# EAGLE design programmer (EAGLE 9.1.2)
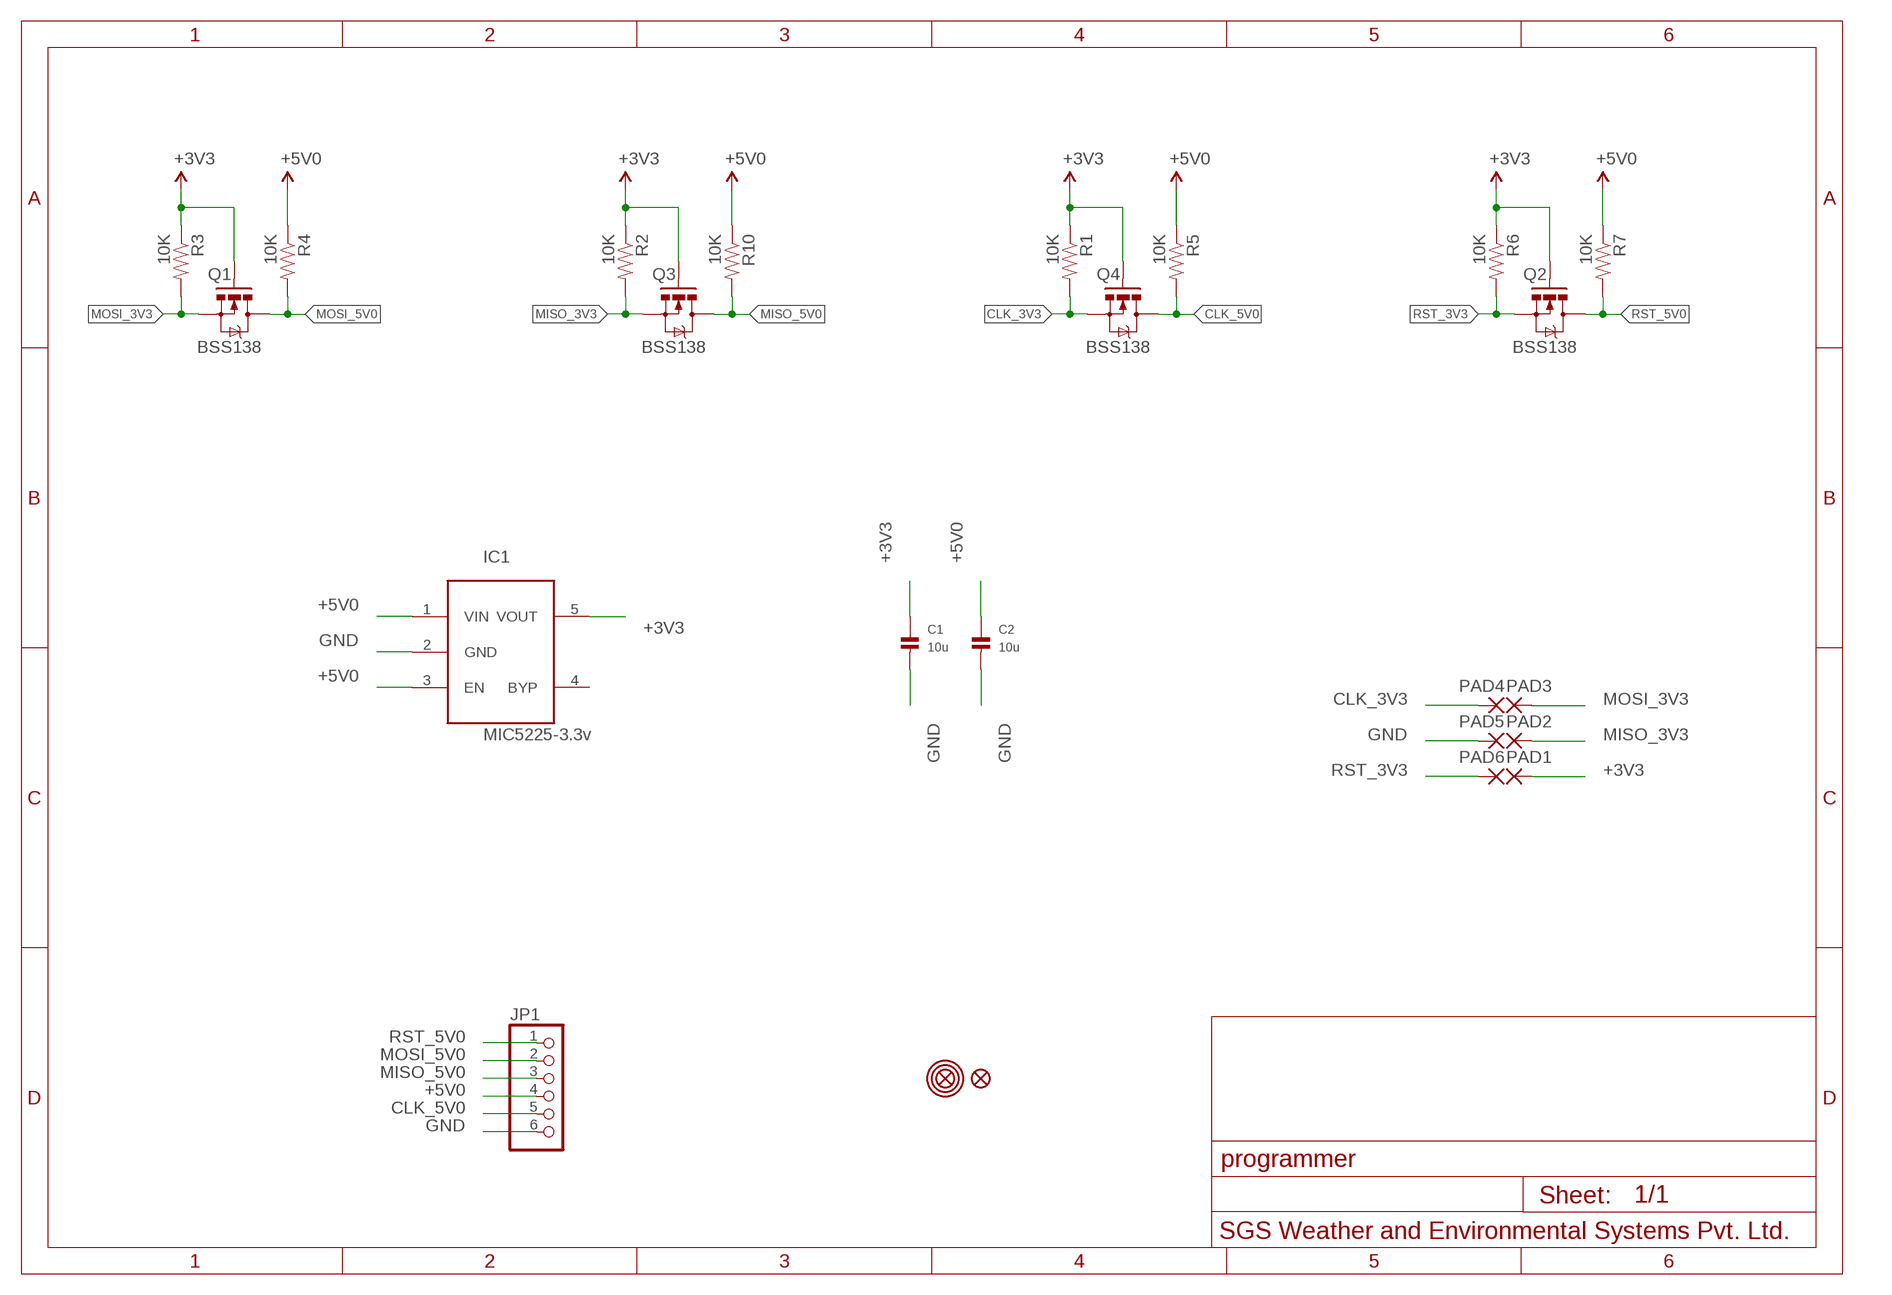
[diagram p0: schematic, sheet 1]

## Parts
C1  10u  CAP_CERAMIC0603  [0603]
C2  10u  CAP_CERAMIC0603  [0603]
FID1  FIDUCIAL1X2.5  [FIDUCIAL-1X2.5]
FID2  FIDUCIAL1X2.5  [FIDUCIAL-1X2.5]
IC1  MIC5225-3.3v  LP298XS  [SOT23-5L]
JP1  HEADER-1X6ROUND  [1X06_ROUND]
PAD1  WIREPADSMD1,27-254  [SMD1,27-2,54]
PAD2  WIREPADSMD1,27-254  [SMD1,27-2,54]
PAD3  WIREPADSMD1,27-254  [SMD1,27-2,54]
PAD4  WIREPADSMD1,27-254  [SMD1,27-2,54]
PAD5  WIREPADSMD1,27-254  [SMD1,27-2,54]
PAD6  WIREPADSMD1,27-254  [SMD1,27-2,54]
Q1  BSS138  MOSFET-NCHANNELSMD  [SOT23-3]
Q2  BSS138  MOSFET-NCHANNELSMD  [SOT23-3]
Q3  BSS138  MOSFET-NCHANNELSMD  [SOT23-3]
Q4  BSS138  MOSFET-NCHANNELSMD  [SOT23-3]
R1  10K  RESISTOR0603-RES  [0603-RES]
R2  10K  RESISTOR0603-RES  [0603-RES]
R3  10K  RESISTOR0603-RES  [0603-RES]
R4  10K  RESISTOR0603-RES  [0603-RES]
R5  10K  RESISTOR0603-RES  [0603-RES]
R6  10K  RESISTOR0603-RES  [0603-RES]
R7  10K  RESISTOR0603-RES  [0603-RES]
R10  10K  RESISTOR0603-RES  [0603-RES]
U$1  MOUNTINGHOLE2.5  [MOUNTINGHOLE_2.5_PLATED]

## Nets
+3V3: C1.1 IC1.5(VOUT) PAD1.1(P) Q1.1(G) Q2.1(G) Q3.1(G) Q4.1(G) R1.1 R2.1 R3.1 R6.1
+5V0: C2.1 IC1.1(VIN) IC1.3(EN) JP1.4 R4.1 R5.1 R7.1 R10.1
CLK_3V3: PAD4.1(P) Q4.2(S) R1.2
CLK_5V0: JP1.5 Q4.3(D) R5.2
GND: C1.2 C2.2 IC1.2(GND) JP1.6 PAD5.1(P)
MISO_3V3: PAD2.1(P) Q3.2(S) R2.2
MISO_5V0: JP1.3 Q3.3(D) R10.2
MOSI_3V3: PAD3.1(P) Q1.2(S) R3.2
MOSI_5V0: JP1.2 Q1.3(D) R4.2
RST_3V3: PAD6.1(P) Q2.2(S) R6.2
RST_5V0: JP1.1 Q2.3(D) R7.2
Unconnected: IC1.4(BYP)

## Library data of the parts
C1 C2 = microbuilder:CAP_CERAMIC: Ceramic Capacitors 0402 - 0402 Surface Mount Capacitors 16pF 50V 5% [Digikey: 445-4899-2-ND] 18pF 50V 5% [Digikey: 490-1281-2-ND] 22pF 50V 5% [Digikey: 490-1283-2-ND] 68pF 50V 5% [Digikey: 490-1289-2-ND] 0.1uF 10V 10% [Digikey: 490-1318-2-ND] 1.0uF 6.3V 10% [Digikey: 490-1320-2-ND] 0603 - 0603 Surface Mount Capacitors 16 pF 50V 5% [Digikey: 445-5051-2-ND] 22 pF 50V [Digikey: PCC220ACVTR-ND] 33 pF 50V 5% [Digikey: 490-1415-1-ND] 56pF 50V 5% [Digikey: 490-1421-1-ND] 220pF 50V 5% [Digikey: 445-1285-1-ND] 680 pF 50V 2200 pF 50V 5% C0G [Digikey: 445-1297-1-ND] 5600 pF 100V 5% X7R [Digikey: 478-3711-1-ND] 0.1 µF 25V 10% [Digikey: PCC2277TR-ND] 0.22 µF 16V 10% X7R [Digikey: 445-1318-1-ND] 1.0 µF 25V 10% [Digikey: 445-5146-2-ND] 0603 - RF Specific 3pF 250V +/-0.1pF RF [Digikey: 712-1347-1-ND] 18 pF 250V 5% [Digikey: 478-3505-1-ND or 712-1322-1-ND] 56 pF 250V 5% C0G RF [Digikey: 490-4867-1-ND] 68 pF 250V RF [Digikey: 490-4868-1-ND] 0805 - 0805 Surface Mount Capacitors 220 pF 250V 2% RF Ceramic Capacitor [Digikey: 712-1398-1-ND] 1000 pF 50V 2% NP0 Ceramic Capacitor [Digikey: 478-3760-1-ND] 0.1 µF 25V 10% Ceramic Capacitor [Digikey: PCC1828TR-ND] 1.0 µF 16V 10% Ceramic Capacitor[Digikey: 490-1691-2-ND] 10.0 µF 10V 10% Ceramic Capacitor[Digikey: 709-1228-1-ND] 10.0 uF 16V 10% Ceramic Capacitor [Digikey: 478-5165-2-ND] 47 uF 6.3V 20% Ceramic Capacitor [Digikey: 587-1779-1-ND or 399-5506-1-ND] 1206 - 1206 Surface Mount Capacitors 47uF 10V 20% Ceramic Capacitor [Digikey: 490-5528-1-ND or 399-5508-1-ND or 445-6010-1-ND] 100uF 6.3V -20%, +80% Y5V Ceramic Capacitor (Digikey: 490-4512-1-ND, Mouser: 81-GRM31CF50J107ZE1L)
FID1 FID2 = microbuilder:FIDUCIAL: Fiducial Alignment Points Various fiducial points for machine vision alignment.; BOM: EXCLUDE
IC1 = adafruit:LP298X
JP1 = microbuilder:HEADER-1X6: PIN HEADER
PAD1-PAD6 = wirepad:WIREPAD: Wire PAD connect wire on PCB
Q1-Q4 = SparkFun:MOSFET-NCHANNEL
R1-R7 R10 = SparkFun:RESISTOR: Resistor Basic schematic elements and footprints for 0603, 1206, and PTH resistors.
U$1 = microbuilder:MOUNTINGHOLE: Mounting Hole For #2 screws (0.086"/2.18mm width, 0.094"/2.4mm hole) use 2.5mm

## Board
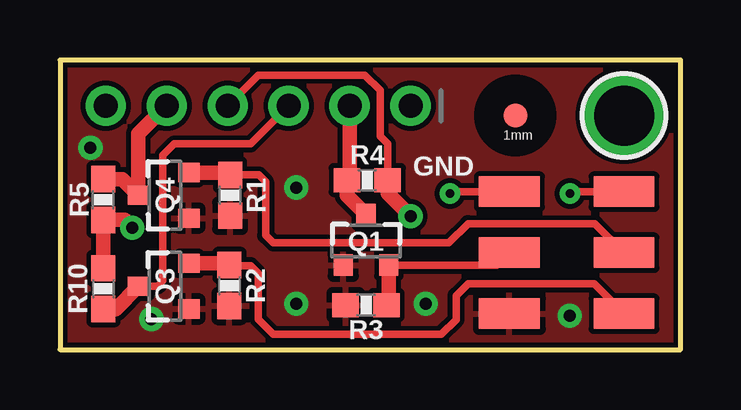
[diagram p1: board, top side]
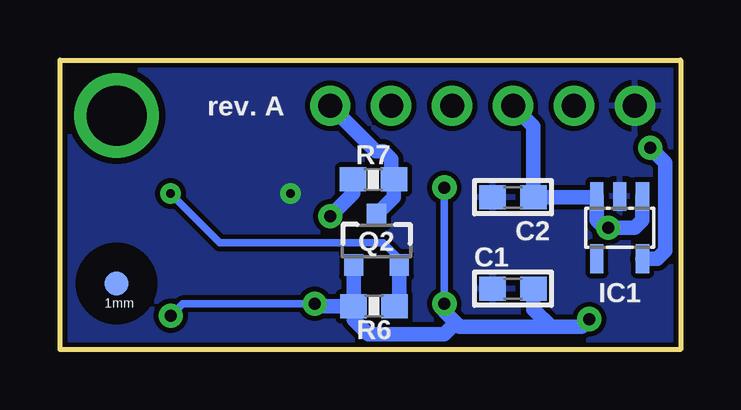
[diagram p2: board, bottom side, seen from below]

Size 25.86 x 12.06 mm. Coordinates in mm from the lower left corner, seen from the top.
Outline: 0,0 25.86,0 25.86,12.06 0,12.06 0,0
Copper layers (1*16): Top 0.035mm / dielectric 1.5mm / Bottom 0.035mm
Design rules "SparkFun *": minimum track width 7mil, minimum drill 15mil, track to track 8mil, track to pad 8mil, pad to pad 8mil, via to via 8mil, smd to smd 8mil, copper to edge 8mil, drill to drill 8mil, minimum pad ring 12mil, minimum via ring 10mil, stop-mask expansion 4mil, vias tented up to drill 20mil, thermal gap 10mil

### Footprints (pad centres in the part's own frame; a part is rotated, then mirrored left to right if it is on the bottom)
0603 = smd 1.1 x 1: 1 -0.85,0; 2 0.85,0
FIDUCIAL-1X2.5 = smd 1 x 1: 1 0,0
SOT23-5L = smd 0.55 x 1.2: 1 -0.95,-1.3; 2 0,-1.3; 3 0.95,-1.3; 4 0.95,1.3; 5 -0.95,1.3
1X06_ROUND = drill 1 pad 1.676: 1 -6.35,0; 2 -3.81,0; 3 -1.27,0; 4 1.27,0; 5 3.81,0; 6 6.35,0
SMD1,27-2,54 = smd 1.27 x 2.54: 1 0,0
SOT23-3 = smd 0.8 x 0.9: 1 -0.95,-1; 2 0.95,-1; 3 0,1.1
0603-RES = smd 1.1 x 1: 1 -0.85,0; 2 0.85,0
MOUNTINGHOLE_2.5_PLATED = drill 2.5 pad 3.2: P$1 0,0

### Placement (x,y rotation side)
C1  6.99,2.54 180 bottom
C2  6.99,6.35 180 bottom
FID1  18.97,9.75 0 top
FID2  23.5,2.75 0 bottom
IC1  2.54,5.08 180 bottom
JP1  8.26,10.16 180 top
PAD1  18.72,1.5 90 top
PAD2  23.5,1.5 90 top
PAD3  18.72,4.04 90 top
PAD4  23.5,4.04 90 top
PAD5  18.72,6.58 90 top
PAD6  23.5,6.58 90 top
Q1  12.75,4.52 0 top
Q2  12.67,4.52 0 bottom
Q3  4.37,2.64 90 top
Q4  4.37,6.43 90 top
R1  7.09,6.43 90 top
R2  7.06,2.67 90 top
R3  12.75,1.85 0 top
R4  12.8,7.06 180 top
R5  1.8,6.25 90 top
R6  12.78,1.8 0 bottom
R7  12.8,7.09 0 bottom
R10  1.8,2.54 270 top
U$1  23.5,9.75 0 top

### Tracks (layer width: path | path; a pad name or v marks a point on that pad's centre or on a via)
+3V3  (via drill 0.5)
  Bottom 0.254: 13.86,3.52 Q2.1
  Bottom 0.305: v9.84,6.75 v9.84,1.91 | v15.24,1.91 20.74,1.91 v21.24,1.41
  Bottom 0.61: IC1.5 0.98,3.78 0.64,4.13 0.64,7.78 v1.27,8.41 | Q2.1 R6.1 | R6.1 13.63,1.24 13.02,0.64 9.84,0.64 9.37,1.11 | R6.1 15.14,1.8 v15.24,1.91 | v9.84,1.91 9.84,1.59 9.37,1.11 | 9.37,1.11 9.21,0.95 5.4,0.95 | 5.4,0.95 4.13,0.95 v3.81,1.27 | C1.1 6.13,1.69 5.4,0.95
  pour Top: 0,12.06 25.86,12.06 25.86,0 0,0
+5V0  (via drill 0.5)
  Top 0.305: R4.1 13.65,8.57 13.34,8.89 13.34,10.79 12.7,11.43 8.26,11.43 JP1.4
  Top 0.61: R10.1 R5.1 2.7,5.4 v3.02,5.08 | R4.1 13.65,6.51 v14.61,5.56
  Bottom 0.61: JP1.4 6.13,9.31 C2.1 3.52,6.35 IC1.3 3.49,5.39 3.17,5.08 v3.02,5.08 1.91,5.08 1.59,5.39 IC1.1 | v14.61,5.56 13.65,6.51 R7.1
CLK_3V3
  Top 0.254: R1.2 6.93,7.12 6.68,7.38
  Top 0.305: R1.2 8.28,7.28 8.57,6.99 8.57,4.76 8.89,4.45 16.2,4.45 17,5.25 22.29,5.25 PAD4.1
  Top 0.61: Q4.2 6.99,7.38 R1.2
CLK_5V0
  Top 0.61: R5.2 2.6,7.1 Q4.3 3.27,8.98 JP1.5
GND  (via drill 0.35)
  Top 0.305: PAD5.1 16.33,6.58 v16.25,6.5
  pour Bottom: 0,12.06 25.86,12.06 25.86,0 0,0
MISO_3V3
  Top 0.254: Q3.2 5.44,3.52
  Top 0.305: R2.2 7.09,3.49 7.94,3.49 8.26,3.17 8.26,1.27 8.89,0.64 15.88,0.64 16.5,1.25 16.5,2.25 17,2.75 22.25,2.75 PAD2.1
  Top 0.61: Q3.2 6.99,3.59 R2.2
MISO_5V0
  Top 0.305: Q3.3 4.07,2.64 4.29,2.86 4.29,8.1 4.76,8.57 7.94,8.57 JP1.3
  Top 0.61: R10.2 2.32,1.69 Q3.3
MOSI_3V3
  Top 0.305: PAD3.1 18.2,3.52 Q1.2
  Top 0.61: Q1.2 13.7,1.95 R3.2
MOSI_5V0
  Top 0.61: Q1.3 11.95,6.42 R4.2 12.06,7.17 JP1.2
RST_3V3  (via drill 0.35)
  Top 0.305: PAD6.1 21.33,6.58 v21.25,6.5
  Bottom 0.305: Q2.2 11.72,3.79 12.38,4.45 19.2,4.45 v21.25,6.5
  Bottom 0.61: Q2.2 11.72,2 R6.2
RST_5V0
  Bottom 0.254: 12.06,7.2 R7.2
  Bottom 0.61: Q2.3 11.95,6.34 R7.2 | 12.06,7.2 12.06,7.94 12.38,8.26 12.7,8.26 JP1.1

### Text on the board
tNames: GND
bNames: rev. A